# EAGLE design equalize_1 (EAGLE 7.4.0)
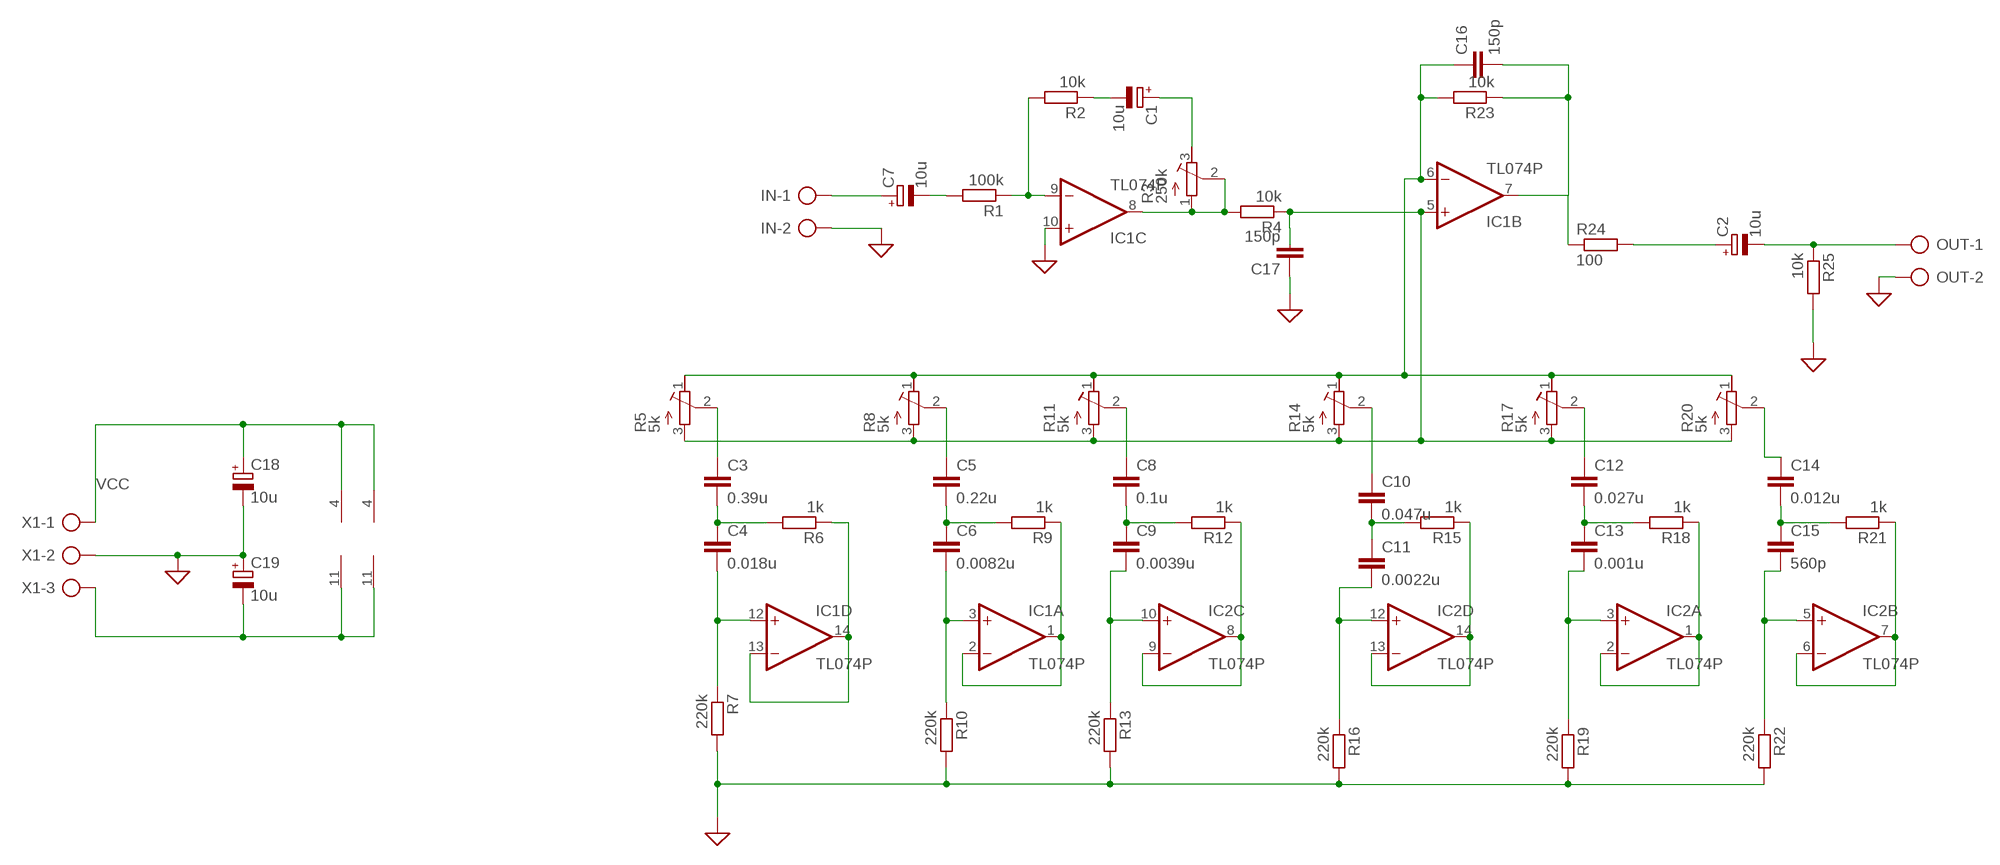
[diagram p0: schematic, sheet 1]

## Parts
C1  10u  CPOL-EUE2.5-5  [E2,5-5]
C2  10u  CPOL-EUE2.5-5  [E2,5-5]
C3  0.39u  C-EUC0603  [C0603]
C4  0.018u  C-EUC0603  [C0603]
C5  0.22u  C-EUC0603  [C0603]
C6  0.0082u  C-EUC0603  [C0603]
C7  10u  CPOL-EUE2.5-5  [E2,5-5]
C8  0.1u  C-EUC0603  [C0603]
C9  0.0039u  C-EUC0603  [C0603]
C10  0.047u  C-EUC0603  [C0603]
C11  0.0022u  C-EUC0603  [C0603]
C12  0.027u  C-EUC0603  [C0603]
C13  0.001u  C-EUC0603  [C0603]
C14  0.012u  C-EUC0603  [C0603]
C15  560p  C-EUC0603  [C0603]
C16  150p  C-EUC0603  [C0603]
C17  150p  C-EUC0603  [C0603]
C18  10u  CPOL-EUE2.5-5  [E2,5-5]
C19  10u  CPOL-EUE2.5-5  [E2,5-5]
IC1  TL074P  [DIL14]
IC2  TL074P  [DIL14]
IN  AK500/2  [AK500/2]
OUT  AK500/2  [AK500/2]
R1  100k  R-EU_0207/7  [0207/7]
R2  10k  R-EU_0207/7  [0207/7]
R3  250k  R-TRIMM3339P  [RTRIM3339P]
R4  10k  R-EU_0207/7  [0207/7]
R5  5k  R-TRIMMT93YA  [RTRIMT93YA]
R6  1k  R-EU_0207/7  [0207/7]
R7  220k  R-EU_0207/7  [0207/7]
R8  5k  R-TRIMMT93YA  [RTRIMT93YA]
R9  1k  R-EU_0207/7  [0207/7]
R10  220k  R-EU_0207/7  [0207/7]
R11  5k  R-TRIMMT93YA  [RTRIMT93YA]
R12  1k  R-EU_0207/7  [0207/7]
R13  220k  R-EU_0207/7  [0207/7]
R14  5k  R-TRIMMT93YA  [RTRIMT93YA]
R15  1k  R-EU_0207/7  [0207/7]
R16  220k  R-EU_0207/7  [0207/7]
R17  5k  R-TRIMMT93YA  [RTRIMT93YA]
R18  1k  R-EU_0207/7  [0207/7]
R19  220k  R-EU_0207/7  [0207/7]
R20  5k  R-TRIMMT93YA  [RTRIMT93YA]
R21  1k  R-EU_0207/7  [0207/7]
R22  220k  R-EU_0207/7  [0207/7]
R23  10k  R-EU_0207/7  [0207/7]
R24  100  R-EU_0207/7  [0207/7]
R25  10k  R-EU_0207/7  [0207/7]
X1  AK500/3  [AK500/3]

## Nets
GND: C17.1 C18.- C19.+ IC1.10(C:+IN) IN.2 OUT.2 R7.2 R10.2 R13.2 R16.2 R19.2 R22.2 R25.2 X1.2 ; supply symbol labelled SUP
IN: C7.+ IN.1
N$1: C1.- R2.1
N$2: C1.+ R3.3(E)
N$3: IC1.8(C:OUT) R3.1(A) R3.2(S) R4.2
N$4: C19.- IC1.11(P:V-) IC2.11(P:V-) X1.3
N$5: C16.2 IC1.7(B:OUT) R23.1 R24.1
N$6: C2.+ R24.2
N$7: C16.1 IC1.6(B:-IN) R5.1(E) R8.1(E) R11.1(E) R14.1(E) R17.1(E) R20.1(E) R23.2
N$8: IC1.9(C:-IN) R1.1 R2.2
N$9: C7.- R1.2
N$12: C17.2 IC1.5(B:+IN) R4.1 R5.3(A) R8.3(A) R11.3(A) R14.3(A) R17.3(A) R20.3(A)
N$13: C3.1 R5.2(S)
N$14: C3.2 C4.1 R6.2
N$15: IC1.13(D:-IN) IC1.14(D:OUT) R6.1
N$16: C4.2 IC1.12(D:+IN) R7.1
N$17: C5.1 R8.2(S)
N$18: C5.2 C6.1 R9.2
N$19: IC1.1(A:OUT) IC1.2(A:-IN) R9.1
N$20: C6.2 IC1.3(A:+IN) R10.1
N$21: C8.1 R11.2(S)
N$22: C8.2 C9.1 R12.2
N$23: IC2.8(C:OUT) IC2.9(C:-IN) R12.1
N$24: C9.2 IC2.10(C:+IN) R13.1
N$25: C10.1 R14.2(S)
N$26: C10.2 C11.1 R15.2
N$27: IC2.13(D:-IN) IC2.14(D:OUT) R15.1
N$28: C11.2 IC2.12(D:+IN) R16.1
N$29: C12.1 R17.2(S)
N$30: C12.2 C13.1 R18.2
N$31: IC2.1(A:OUT) IC2.2(A:-IN) R18.1
N$32: C13.2 IC2.3(A:+IN) R19.1
N$33: C14.1 R20.2(S)
N$34: C14.2 C15.1 R21.2
N$35: IC2.6(B:-IN) IC2.7(B:OUT) R21.1
N$36: C15.2 IC2.5(B:+IN) R22.1
OUT: C2.- OUT.1 R25.1
VCC: C18.+ IC1.4(P:V+) IC2.4(P:V+) X1.1

## Library data of the parts
C1 C2 C7 C18 C19 = rcl:CPOL-EU: POLARIZED CAPACITOR, European symbol
C3-C6 C8-C17 = rcl:C-EU: CAPACITOR, European symbol
IC1 IC2 = linear:TL074: OP AMP
IN OUT = con-ptr500:AK500/2: CONNECTOR; OC_FARNELL: unknown; OC_NEWARK: unknown
R1 R2 R4 R6 R7 R9 R10 R12 R13 R15 R16 R18 R19 R21-R25 = rcl:R-EU_: RESISTOR, European symbol
R3 = rcl:R-TRIMM: Trimm resistor
R5 R8 R11 R14 R17 R20 = resistor:R-TRIMM: Trimm resistor
X1 = con-ptr500:AK500/3: CONNECTOR; OC_FARNELL: unknown; OC_NEWARK: unknown

## Net classes
0 net: width 0.508 mm, drill 0.254 mm, clearance 0.66 mm

## Board
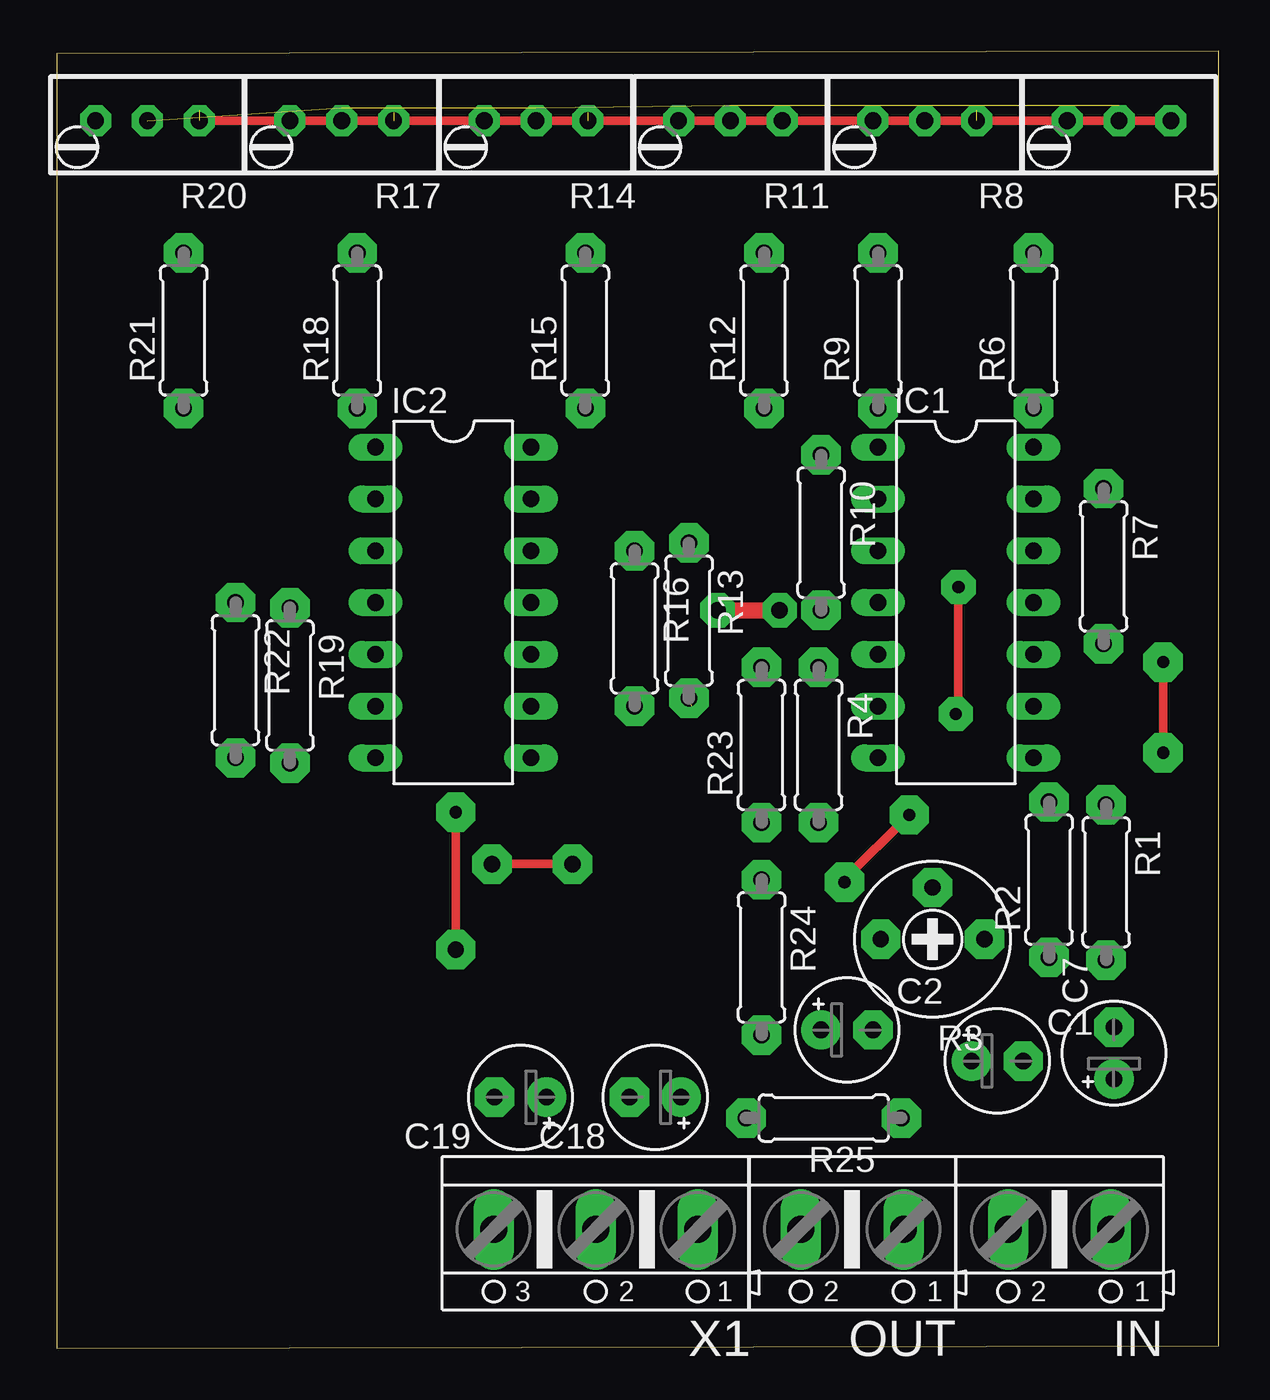
[diagram p1: board, top side]
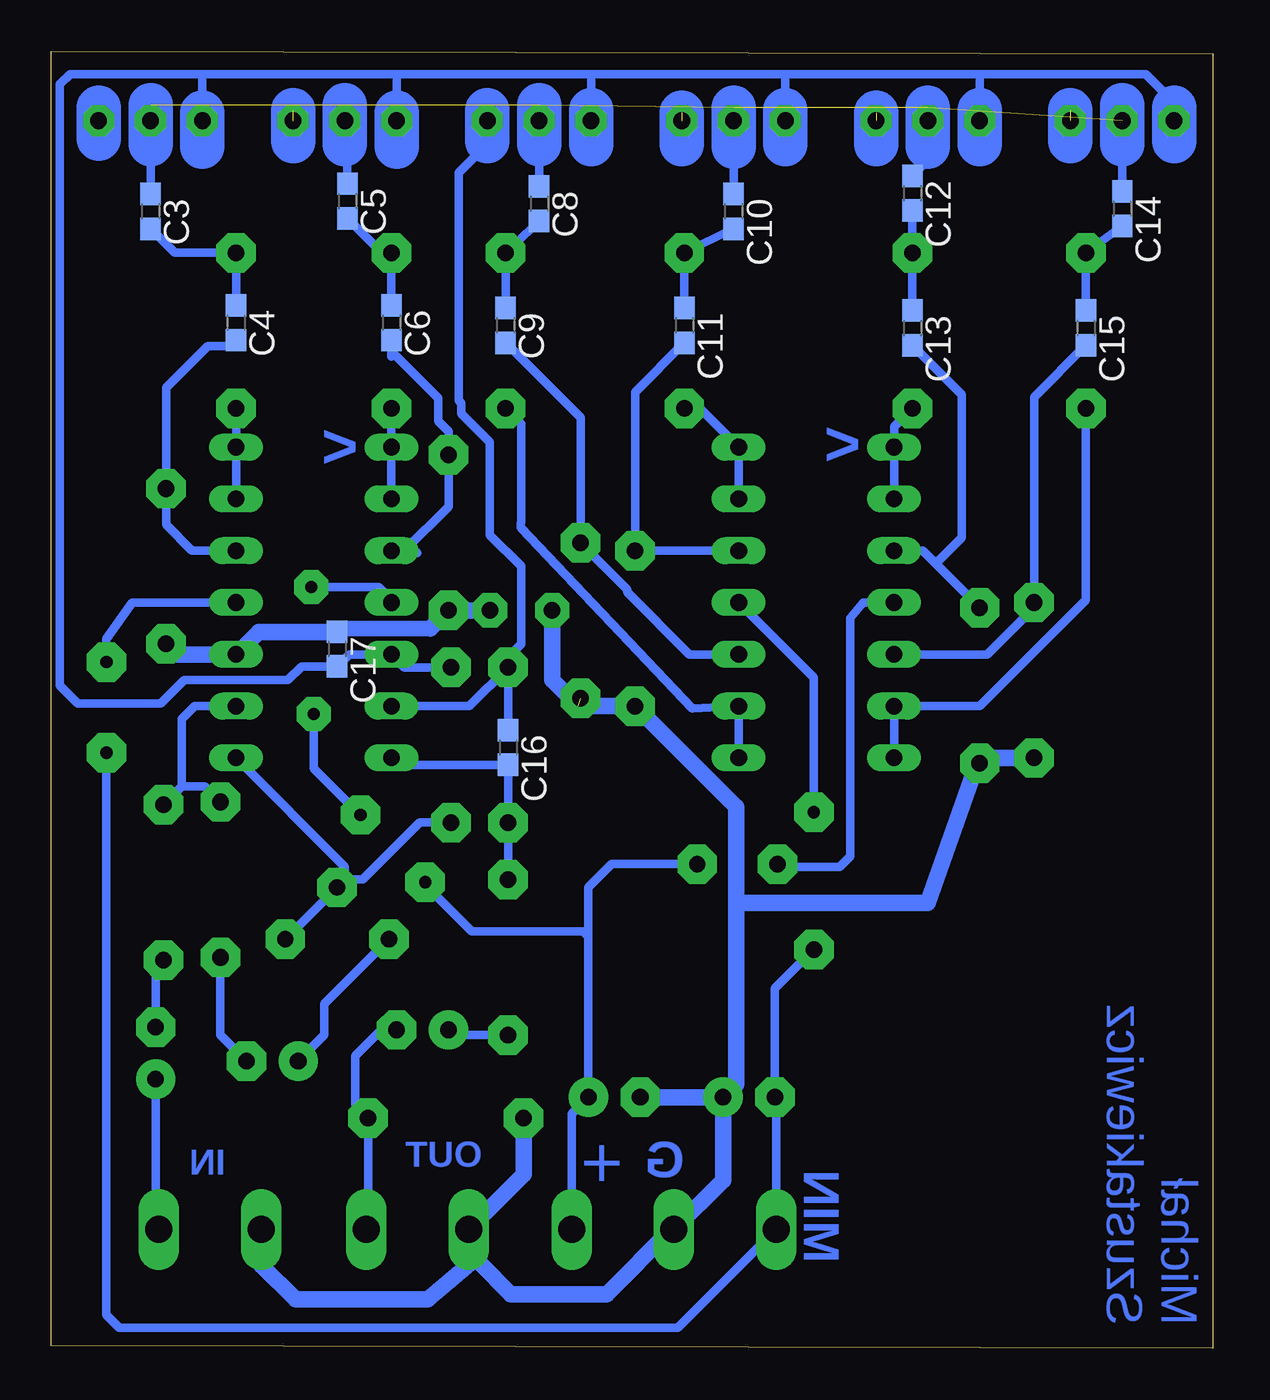
[diagram p2: board, bottom side, seen from below]

Size 56.95 x 63.62 mm. Coordinates in mm from the lower left corner, seen from the top.
Outline: 0,0 56.95,0.13 56.95,63.62 0,63.49 0,0
Copper layers (1*16): Top 0.035mm / dielectric 1.5mm / Bottom 0.035mm
Design rules "default": minimum track width 6mil, minimum drill 0.35mm, track to track 6mil, track to pad 6mil, pad to pad 6mil, via to via 6mil, smd to smd 6mil, copper to edge 40mil, drill to drill 6mil, minimum pad ring 10mil, minimum via ring 8mil, stop-mask expansion 4mil, vias tented up to drill 0mil, thermal gap 10mil

### Footprints (pad centres in the part's own frame; a part is rotated, then mirrored left to right if it is on the bottom)
E2,5-5 = drill 0.813 pad 1.93: + -1.27,0 | drill 0.813 pad 1.93 octagon: - 1.27,0
C0603 = smd 1.1 x 1: 1 -0.85,0; 2 0.85,0
DIL14 = drill 0.813 long: 1 -7.62,-3.81; 2 -5.08,-3.81; 3 -2.54,-3.81; 4 0,-3.81; 5 2.54,-3.81; 6 5.08,-3.81; 7 7.62,-3.81; 8 7.62,3.81; 9 5.08,3.81; 10 2.54,3.81; 11 0,3.81; 12 -2.54,3.81; 13 -5.08,3.81; 14 -7.62,3.81
AK500/2 = drill 1.321 long: 1 -2.515,0; 2 2.515,0
0207/7 = drill 0.813 pad 1.93 octagon: 1 -3.81,0; 2 3.81,0
RTRIM3339P = drill 0.8 pad 1.93 octagon: 1 -2.54,0; 2 0,-2.54; 3 2.54,0
RTRIMT93YA = drill 0.813 pad 1.524 octagon: 1 0,-2.54; 2 0,0; 3 0,2.54
AK500/3 = drill 1.321 long: 1 -5.004,0; 2 0,0; 3 5.004,0

### Placement (x,y rotation side)
C1  46.1,14.1 0 top
C2  38.73,15.62 0 top
C3  52.07,55.75 270 bottom
C4  47.88,50.29 270 bottom
C5  42.42,56.26 270 bottom
C6  40.26,50.29 270 bottom
C7  51.82,14.48 90 top
C8  33.02,56.13 270 bottom
C9  34.67,50.16 270 bottom
C10  23.49,55.75 270 bottom
C11  25.91,50.16 270 bottom
C12  14.73,56.64 270 bottom
C13  14.73,50.04 270 bottom
C14  4.45,55.88 270 bottom
C15  6.22,50.04 270 bottom
C16  34.54,29.46 270 bottom
C17  42.93,34.29 270 bottom
C18  29.34,12.32 180 top
C19  22.73,12.32 180 top
IC1  44.07,36.58 270 top
IC2  19.43,36.58 270 top
IN  49.15,5.84 180 top
OUT  38.99,5.84 180 top
R1  51.44,22.86 270 top
R2  48.64,22.99 90 top
R3  42.93,20.07 180 top
R4  37.34,29.59 270 top
R5  52.07,60.2 90 top
R6  47.88,49.91 90 top
R7  51.31,38.35 270 top
R8  42.55,60.2 90 top
R9  40.26,49.91 90 top
R10  37.47,40 270 top
R11  33.02,60.2 90 top
R12  34.67,49.91 90 top
R13  30.99,35.69 270 top
R14  23.49,60.2 90 top
R15  25.91,49.91 90 top
R16  28.32,35.31 270 top
R17  13.97,60.2 90 top
R18  14.73,49.91 90 top
R19  11.43,32.51 270 top
R20  4.45,60.2 90 top
R21  6.22,49.91 90 top
R22  8.76,32.77 270 top
R23  34.54,29.59 90 top
R24  34.54,19.18 270 top
R25  37.59,11.3 180 top
X1  26.42,5.84 180 top

### Tracks (layer width: path | path; a pad name or v marks a point on that pad's centre or on a via)
GND  (via drill 0.6, 0.8 pad 1.68)  (1 unrouted)
  Top 0.813: v32.38,36.2 v35.43,36.2
  Bottom 0.406: 35.94,4.19 35.94,4.57
  Bottom 0.75: 38.35,35.31 42.76,35.31
  Bottom 0.813: R22.2 11.18,28.96 R19.2 11.56,28.7 13.97,21.84 23.37,21.84 | 23.37,21.84 23.37,26.54 R16.2 31.11,31.5 32.38,32.77 v32.38,36.2 | 23.37,21.84 23.37,12.95 C19.+ | C19.+ C18.- | C19.+ 24,8.25 X1.2 26.54,5.84 29.72,2.67 34.42,2.67 35.94,4.19 | R25.2 33.78,8.53 OUT.2 35.94,5.31 35.94,4.57 38.48,2.41 44.96,2.41 46.61,4.06 46.61,4.19 46.63,4.22 IN.2 | v35.43,36.2 R10.2 38.35,35.31 | 42.76,35.31 C17.1 46.77,35.14 IC1.10 50.8,34.04 R7.2
IN
  Bottom 0.406: C7.+ 51.82,5.99 IN.1
N$1
  Bottom 0.406: R2.1 48.64,15.37 C1.-
N$2
  Bottom 0.406: C1.+ 43.56,15.37 43.56,16.89 R3.3
N$3
  Bottom 0.406: IC1.8 42.55,23.62 42.55,22.99 | R4.2 38.86,25.78 41.66,22.99 42.55,22.99 | 42.55,22.99 R3.2 R3.1
N$4  (via drill 0.6 pad 1.93, 0.8 pad 1.93)
  Top 0.406: v54.23,33.66 v54.23,29.21 | v19.56,19.56 v19.56,26.29
  Bottom 0.406: IC1.11 52.96,36.58 54.23,34.8 v54.23,33.66 | v54.23,29.21 54.23,1.65 53.59,1.02 26.24,1.02 X1.3 21.41,12.27 C19.- 21.46,17.65 v19.56,19.56 | v19.56,26.29 19.56,32.89 IC2.11
N$5
  Bottom 0.406: R24.1 R23.1 C16.2 39.92,28.61 IC1.7
N$6
  Bottom 0.406: R24.2 37.21,15.37 C2.+
N$7  (4 unrouted)
  Top 0.406: R5.1 R8.1 R11.1 R14.1 R17.1 R20.1
  Bottom 0.406: R23.2 C16.1 | IC1.6 36.45,31.5 R23.2 | R23.2 34.54,33.91 33.91,34.54 33.91,38.35 35.43,39.88 35.43,44.45 36.83,45.85 36.83,46.35 36.96,46.48 36.96,57.66 35.56,59.05 35.56,59.18 R11.1
  Bottom 2.184: 16.51,60.58 16.51,59.05 | 26.03,60.58 26.03,59.05 | 6.98,60.71 6.98,59.18 | 35.56,60.71 35.56,59.18 | 45.08,60.71 45.08,59.18 | 54.61,60.83 R5.1 54.61,59.31
N$8
  Bottom 0.406: IC1.9 49.91,31.5 50.55,30.86 50.55,27.56 | 50.55,27.56 R1.1 | 50.55,27.56 49.4,27.56 R2.2
N$9
  Bottom 0.406: C7.- 51.82,18.67 R1.2
N$12
  Bottom 0.406: R8.3 40,60.58 40,62.36 39.88,62.48 | 30.48,60.71 30.48,62.1 | R14.3 20.95,60.71 20.95,62.48 | R17.3 11.43,60.71 11.43,62.48 | R4.1 39.62,33.4 IC1.5 42.33,34.04 C17.2 44.66,33.44 45.34,32.77 50.42,32.77 51.56,31.62 55.63,31.62 56.52,32.51 56.52,61.98 56.01,62.48 49.53,62.48 | 1.9,60.83 2.16,61.09 2.16,61.34 3.3,62.48 11.43,62.48 | 49.53,62.48 39.88,62.48 | 39.88,62.48 30.61,62.48 | 30.61,62.48 20.95,62.48 | 20.95,62.48 11.43,62.48 | R11.3 30.48,62.36 30.61,62.48 | 49.53,60.58 49.53,62.48
  Bottom 2.184: 11.43,60.71 11.43,59.05 | 20.95,60.71 20.95,59.05 | 30.48,60.71 R11.3 30.48,59.05 | 40,60.58 40,58.93 | 1.9,60.83 R20.3 1.9,59.18 | 49.53,60.58 R5.3 49.53,58.93
N$13
  Bottom 0.406: R5.2 C3.1
N$14
  Bottom 0.406: C4.1 R6.2 50.89,53.72 C3.2
N$15
  Bottom 0.406: IC1.13 IC1.14 R6.1
N$16
  Bottom 0.406: 48.13,49.44 C4.2 48.17,49.15 49.28,49.15 51.31,47.12 R7.1 51.31,40.39 50.04,39.12 IC1.12
N$17
  Bottom 0.406: C5.1 42.42,60.07 R8.2
N$18
  Bottom 0.406: C6.1 R9.2 40.73,53.72 C5.2
N$19
  Bottom 0.406: R9.1 IC1.1 IC1.2
N$20
  Bottom 0.406: 38.99,38.99 39.12,39.12 39.62,39.12 | 39.62,39.12 IC1.3 | 39.62,39.12 37.47,41.27 R10.1 37.47,44.96 37.97,45.47 37.97,46.61 40.26,48.89 | 40.26,48.64 40.26,48.89 | 40.26,48.89 C6.2
N$21
  Bottom 0.406: R11.2 C8.1
N$22
  Bottom 0.406: C9.1 R12.2 C8.2
N$23
  Bottom 0.406: IC2.8 IC2.9 25.53,31.37 33.92,40.25 33.92,40.48 33.91,40.49 33.91,45.34 34.54,46.1 R12.1
N$24
  Bottom 0.406: IC2.10 25.65,34.04 28.7,37.08 28.7,37.21 R13.1 30.99,45.63 C9.2
N$25
  Bottom 0.406: R14.2 C10.1
N$26
  Bottom 0.406: C10.2 R15.2 C11.1
N$27
  Bottom 0.406: IC2.13 IC2.14 25.15,46.1 R15.1
N$28
  Bottom 0.406: IC2.12 R16.1 28.32,46.9 C11.2
N$29
  Bottom 0.406: R17.2 13.97,58.25 C12.1
N$30
  Bottom 0.406: C13.1 R18.2 C12.2
N$31
  Bottom 0.406: IC2.2 IC2.1 15.62,45.21 R18.1
N$32
  Bottom 0.406: R19.1 13.72,38.61 | 13.72,38.61 14.22,39.12 IC2.3 | C13.2 12.32,46.77 12.32,39.75 13.46,38.61 13.72,38.61
N$33  (5 unrouted)
  Bottom 0.406: R20.2 C14.1
  Bottom 2.184: 13.97,60.83 13.97,58.93 | 23.49,60.83 23.49,58.93 | 33.02,60.96 33.02,59.05 | 42.55,60.96 42.55,59.05 | 52.07,60.96 52.07,59.05 | 4.45,60.96 R20.2 4.45,59.05
N$34
  Bottom 0.406: C14.2 R21.2 C15.1
N$35
  Bottom 0.406: R21.1 6.22,36.7 11.43,31.5 IC2.6 IC2.7
N$36
  Bottom 0.406: IC2.5 11.05,34.04 9.02,36.07 R22.1 8.76,46.65 C15.2
OUT
  Bottom 0.406: C2.- 40.77,15.62 42.04,14.35 42.04,11.94 R25.1 41.4,5.94 OUT.1
VCC  (via drill 0.6 pad 1.68, 0.6 pad 1.93, 0.8 pad 1.93)
  Top 0.406: 44.07,31.5 v44.07,31.11 44.2,31.75 v44.2,37.34 | v21.34,23.75 v25.27,23.75 | v38.61,22.86 38.61,22.99 v41.78,26.16
  Bottom 0.406: X1.1 31.42,11.51 C18.+ 30.61,20.19 | v44.07,31.11 44.07,28.45 v41.78,26.16 | IC2.4 17.14,36.58 17.78,35.81 17.78,24.13 18.29,23.62 21.21,23.62 v21.34,23.75 | v44.2,37.34 40.89,37.34 40.26,36.7 IC1.4 | v25.27,23.75 29.46,23.75 30.61,22.61 30.61,20.19 | 30.61,20.19 30.86,20.45 36.32,20.45 38.48,22.61 38.48,22.73 v38.61,22.86

### Text on the board
Bottom: > | > | OUT | G | + | IN | MIN | Michał / Szustakiewicz